# EAGLE design H2BR10 (EAGLE 9.6.2)

## Sheet 1 of 2
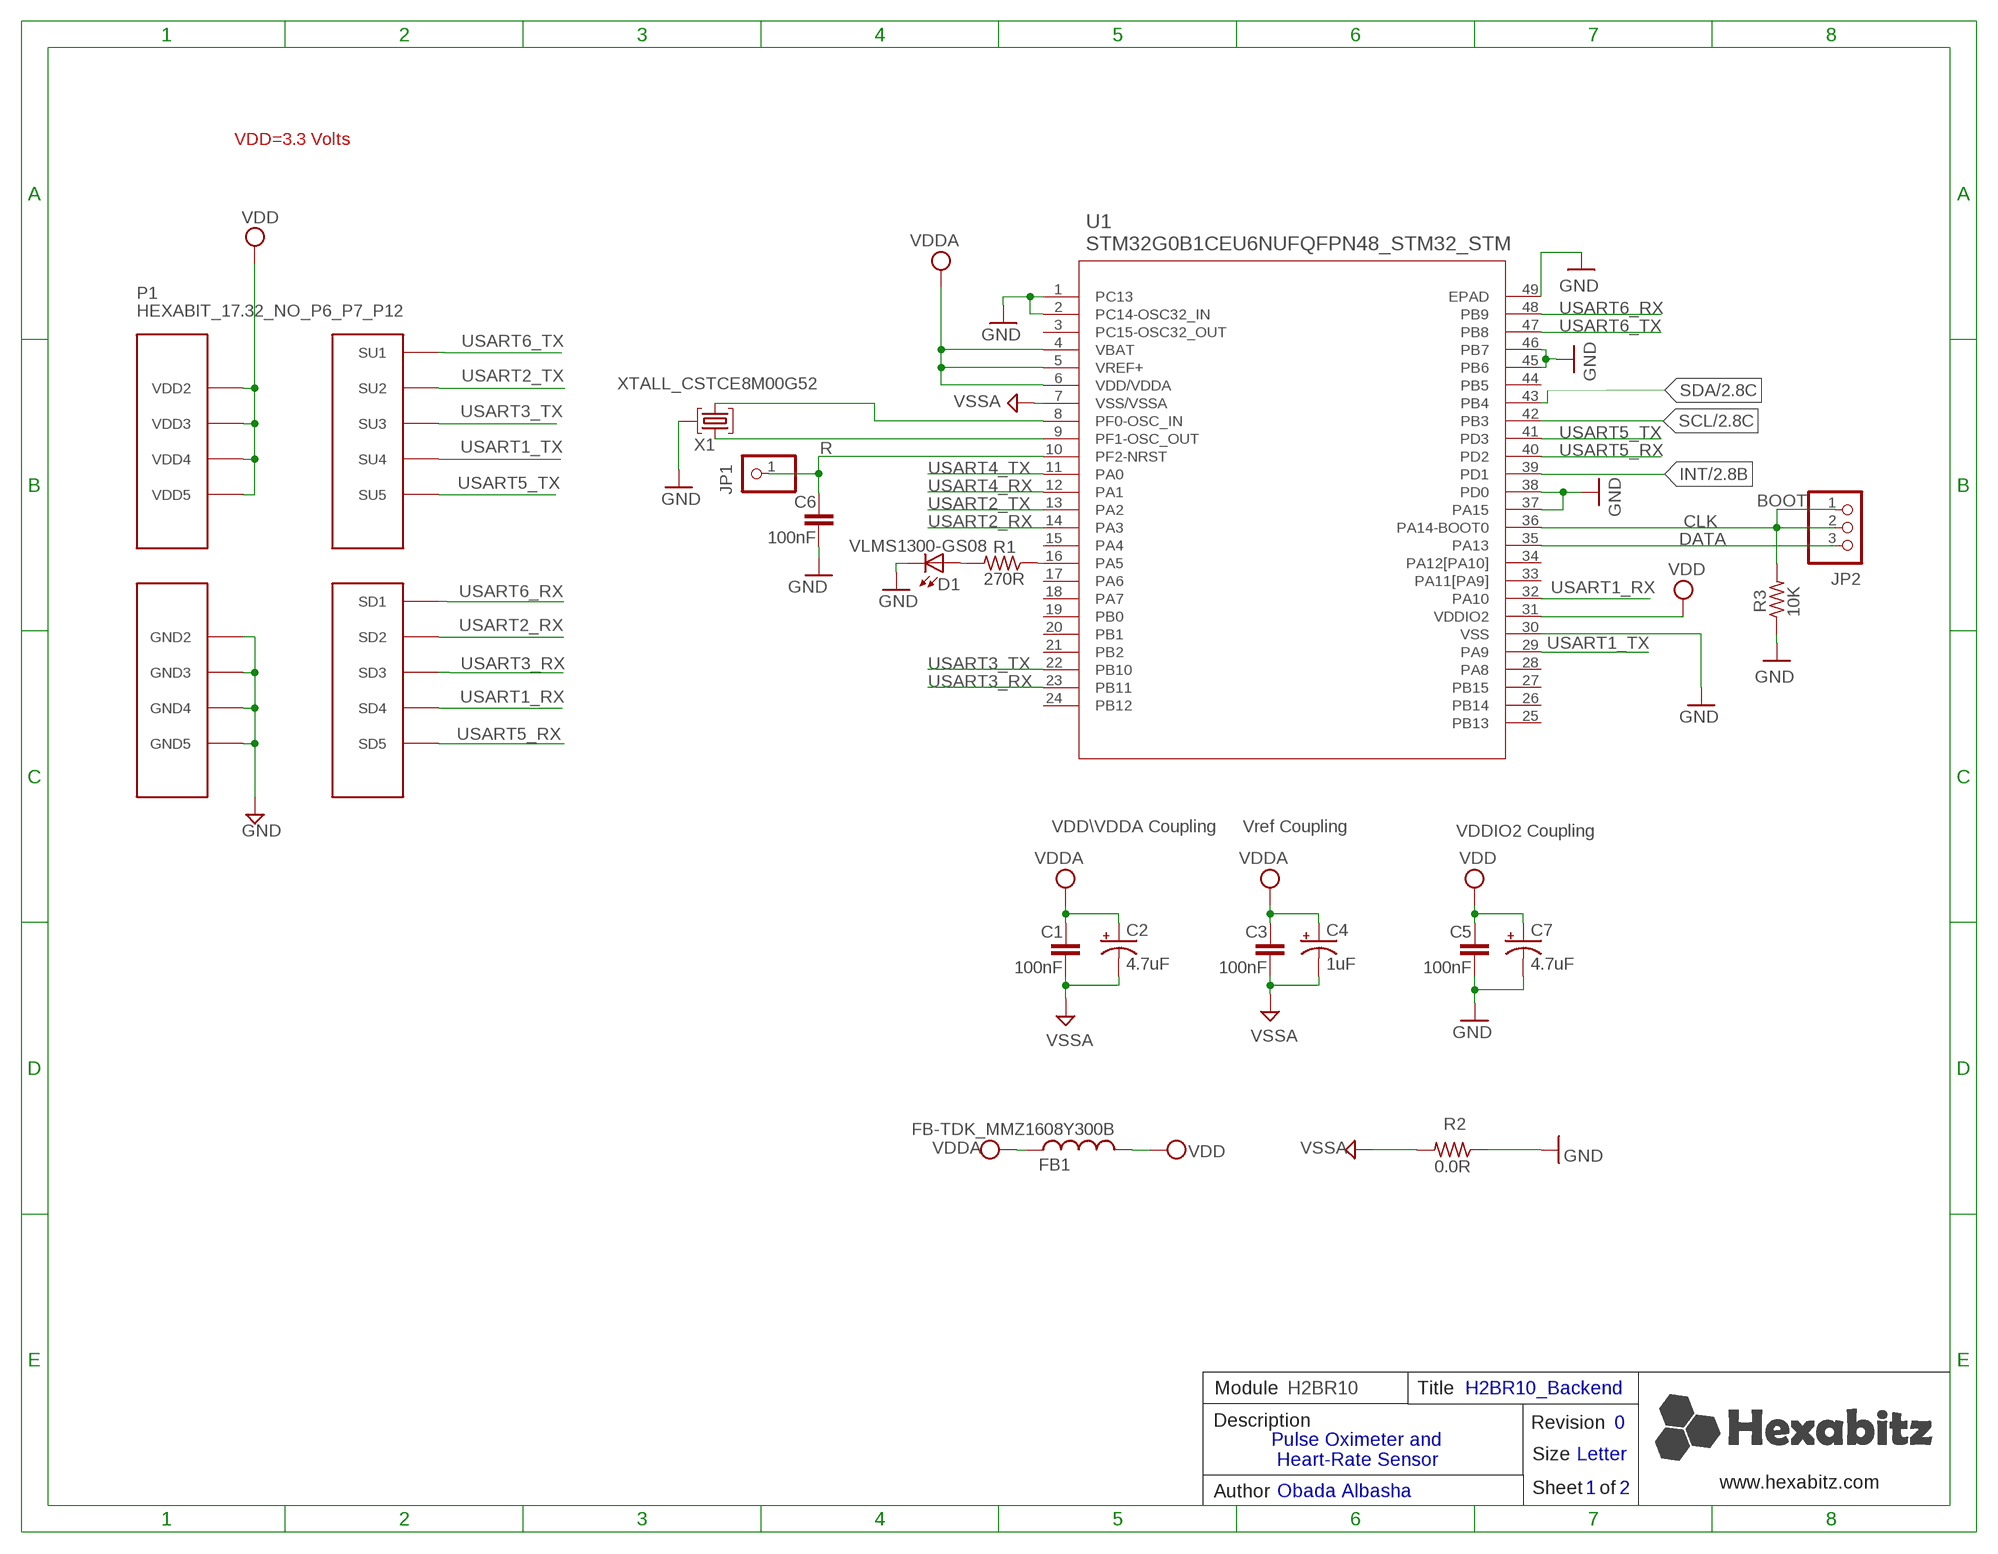
[diagram p0: schematic, sheet 1]

### Parts
C1  100nF  C-0603  [C-0603]
C2  4.7uF  C-0805-POL  [C-0805-POL]
C3  100nF  C-0603  [C-0603]
C4  1uF  C-0805-POL  [C-0805-POL]
C5  100nF  C-0603  [C-0603]
C6  100nF  C-0603  [C-0603]
C7  4.7uF  C-0805-POL  [C-0805-POL]
D1  VLMS1300-GS08  [VLMS1300-GS08]
FB1  FB-TDK_MMZ1608Y300B  [FB-TDK_MMZ1608Y300B]
JP1  R  PINHD-1X1  [1X01]
JP2  PINHD-1X3  [1X03]
P1  HEXABIT_17.32_NO_P6_P7_P12  [HEXABIT_17.32_NO_P6_P7_P12]
R1  270R  R-0603  [R-0603]
R2  0.0R  R-0603  [R-0603]
R3  10K  R-0603  [R-0603]
U1  STM32G0B1CEU6NUFQFPN48_STM32_STM  [UFQFPN48_STM32_STM]
X1  XTALL_CSTCE8M00G52  [XTALL_CSTCE8M00G52]

### Nets
CLK: JP2.1 JP2.2 R3.2 U1.36(PA14-BOOT0)
DATA: JP2.3 U1.35(PA13)
GND: C5.2 C6.2 C7.2(-) D1.C P1.PAD_PD8(GND2) P1.PAD_PD9(GND3) P1.PAD_PD10(GND4) P1.PAD_PD11(GND5) R2.1 R3.1 U1.1(PC13) U1.2(PC14-OSC32_IN) U1.30(VSS) U1.37(PA15) U1.38(PD0) U1.45(PB6) U1.46(PB7) U1.49(EPAD) X1.P$2 ; also sheet 2
INT: U1.39(PD1) ; also sheet 2
N$1: R1.1 U1.16(PA5)
N$3: D1.A R1.2
N$4: C6.1 JP1.1 U1.10(PF2-NRST)
N$5: U1.9(PF1-OSC_OUT) X1.P$1
N$6: U1.8(PF0-OSC_IN) X1.P$3
SCL: U1.42(PB3) ; also sheet 2
SDA: U1.43(PB4) ; also sheet 2
USART1_RX: P1.PAD_PD4(SD4) U1.32(PA10)
USART1_TX: P1.PAD_PU4(SU4) U1.29(PA9)
USART2_RX: P1.PAD_PD2(SD2) U1.14(PA3)
USART2_TX: P1.PAD_PU2(SU2) U1.13(PA2)
USART3_RX: P1.PAD_PD3(SD3) U1.23(PB11)
USART3_TX: P1.PAD_PU3(SU3) U1.22(PB10)
USART4_RX: U1.12(PA1)
USART4_TX: U1.11(PA0)
USART5_RX: P1.PAD_PD5(SD5) U1.40(PD2)
USART5_TX: P1.PAD_PU5(SU5) U1.41(PD3)
USART6_RX: P1.PAD_PD1(SD1) U1.48(PB9)
USART6_TX: P1.PAD_PU1(SU1) U1.47(PB8)
VDD: C5.1 C7.1(+) FB1.2 P1.PAD_PU8(VDD2) P1.PAD_PU9(VDD3) P1.PAD_PU10(VDD4) P1.PAD_PU11(VDD5) U1.31(VDDIO2) ; also sheet 2
VDDA: C1.1 C2.1(+) C3.1 C4.1(+) FB1.1 U1.4(VBAT) U1.5(VREF+) U1.6(VDD/VDDA)
VSSA: C1.2 C2.2(-) C3.2 C4.2(-) R2.2 U1.7(VSS/VSSA)
Unconnected: U1.3(PC15-OSC32_OUT) U1.15(PA4) U1.17(PA6) U1.18(PA7) U1.19(PB0) U1.20(PB1) U1.21(PB2) U1.24(PB12) U1.25(PB13) U1.26(PB14) U1.27(PB15) U1.28(PA8) U1.33(PA11[PA9]) U1.34(PA12[PA10]) U1.44(PB5)

### Notes on the sheet
- VDD=3.3 Volts
- BOOT
- VDD\VDDA Coupling | Vref Coupling | VDDIO2 Coupling
- Module | H2BR10 | Title | H2BR10_Backend
- Description | Revision | 0
- Size | Letter
- Pulse Oximeter and
   Heart-Rate Sensor
- www.hexabitz.com
- Author | Obada Albasha | Sheet   of | 1 | 2
- C:/Users/Admin/Desktop/logodraft.bmp

## Sheet 2 of 2
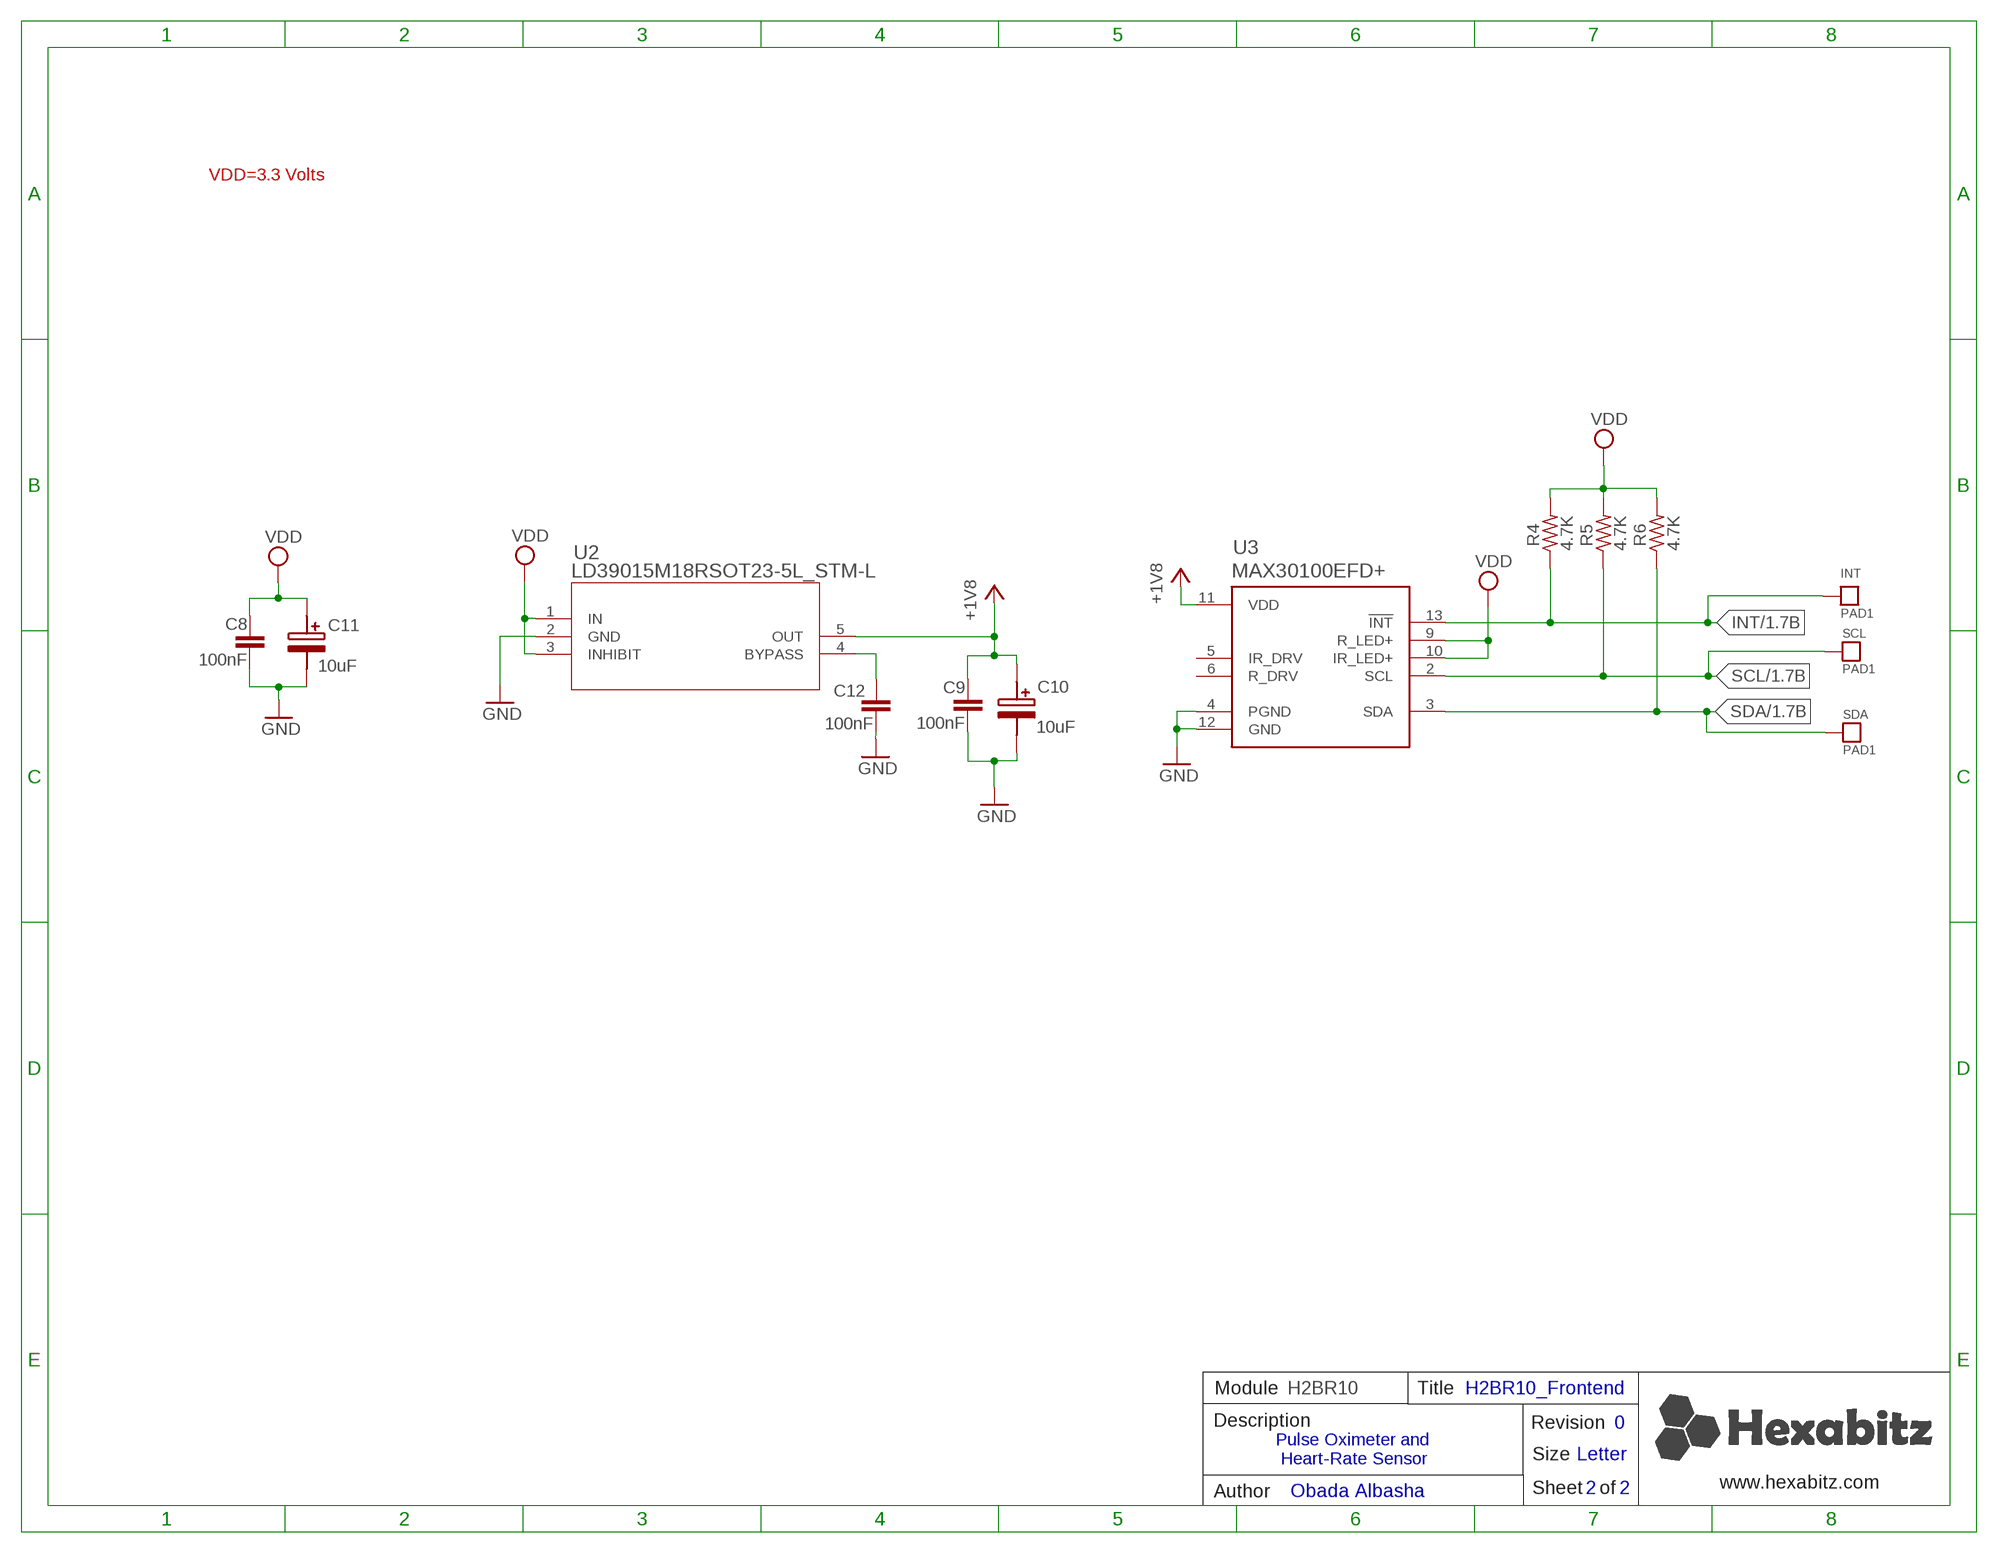
[diagram p1: schematic, sheet 2]

### Parts
C8  100nF  C-0603  [C-0603]
C9  100nF  C-0603  [C-0603]
C10  10uF  T491A106K010AT  [T491A]
C11  10uF  T491A106K010AT  [T491A]
C12  100nF  C-0603  [C-0603]
INT  PAD1  PAD4  [PAD4]
R4  4.7K  R-0603  [R-0603]
R5  4.7K  R-0603  [R-0603]
R6  4.7K  R-0603  [R-0603]
SCL  PAD1  PAD4  [PAD4]
SDA  PAD1  PAD4  [PAD4]
U2  LD39015M18RSOT23-5L_STM-L  [SOT23-5L_STM-L]
U3  MAX30100EFD+  [LGA14R80P2X7_560X280X130]

### Nets
+1V8: C9.1 C10.1(+) U2.5(OUT) U3.11(VDD)
GND: C8.2 C9.2 C10.2(-) C11.2(-) C12.2 U2.2(GND) U3.4(PGND) U3.12(GND) ; also sheet 1
INT: INT.P$1 R4.1 U3.13(!INT) ; also sheet 1
N$2: C12.1 U2.4(BYPASS)
SCL: R5.1 SCL.P$1 U3.2(SCL) ; also sheet 1
SDA: R6.1 SDA.P$1 U3.3(SDA) ; also sheet 1
VDD: C8.1 C11.1(+) R4.2 R5.2 R6.2 U2.1(IN) U2.3(INHIBIT) U3.9(R_LED+) U3.10(IR_LED+) ; also sheet 1
Unconnected: U3.5(IR_DRV) U3.6(R_DRV)

### Notes on the sheet
- VDD=3.3 Volts
- Module | H2BR10 | Title | H2BR10_Frontend
- Description | Revision | 0
- Size | Letter
- Pulse Oximeter and
   Heart-Rate Sensor
- www.hexabitz.com
- Author | Obada Albasha | Sheet   of | 2 | 2

## Library data of the parts
C1 C3 C5 C6 C8 C9 C12 = HEXABITZ_RCLS:C-0603: CAP CER 10% X7R 0603
C2 C4 C7 = HEXABITZ_RCLS:C-0805-POL: Cap Tant Solid SMD 2012
C10 C11 = HEXABITZ_RCLS:T491A106K010AT: T491, Tantalum, MnO2 Tantalum, Commercial Grade, 10 uF, 10%, 10 VDC, 125?C, -55?C, 85?C, SMD, MnO2, Molded, 6 % , 3.8 Ohms, 1000 nA, 58.6 mg, 3216, 1.6mm, Height Max = 1.8mm, 2000, 156 Weeks Source: Datasheet <https://content.kemet.com/datasheets/KEM_T2005_T491.pdf>; DESCRIPTION: T491, Tantalum, MnO2 Tantalum, Commercial Grade, 10 uF, 10%, 10 VDC, 125?C, -55?C, 85?C, SMD, MnO2, Molded, 6 % , 3.8 Ohms, 1000 nA, 58.6 mg, 3216, 1.6mm, Height Max = 1.8mm, 2000, 156 Weeks; HEIGHT: 1.8mm; MANUFACTURER_NAME: KEMET; MANUFACTURER_PART_NUMBER: T491A106K010AT; MOUSER_PART_NUMBER: 80-T491A106K010; MOUSER_PRICE-STOCK: https://www.mouser.co.uk/ProductDetail/KEMET/T491A106K010AT?qs=VCf6WUQjPgE2CESwzh%252BRVg%3D%3D
D1 = Hexabitz:VLMS1300-GS08: Red 0603 130° Clear 54 mcd 2 V Surface Mount ChipLED ; Octopart Url : http://octopart.com/vlms1300-gs08-vishay-21709201; MFN: Vishay; MPN: VLMS1300-GS08; OCTOPART_URL: https://octopart.com/vlms1300-gs08-vishay-21709201?r=sp&s=_gcP4_q8T1SC6PJQPTQ9yA
FB1 = HEXABITZ_RCLS:FB-TDK_MMZ1608Y300B: Ferrite Beads Multi-Layer 30Ohm 25% 100MHz 1.5A 50mOhm DCR 0603; MFN: TDK; MPN: MMZ1608Y300B; OCTOPART_URL: https://octopart.com/mmz1608y300b-tdk-368280?r=sp&s=cd9_2ZEqQ9q9UNBuQgHAiA
INT SCL SDA = HEXABITZ_CONNECTION_PARTS:PAD4
JP1 = HEXABITZ_USER_INTERFACE_PARTS:PINHD-1X1: PIN HEADER; MFN: TE Connectivity; MPN: 87227-1; OCTOPART_URL: https://octopart.com/87227-1-te+connectivity-39512052?r=sp
JP2 = pinhead:PINHD-1X3: PIN HEADER
P1 = hexabitz_connectors:HEXABIT_?_NO_P6_P7_P12: Hexabitz Hexagon Module Connector Hexagon side length = 17.32mm. The following ports are removed: P6 P7 P12
R1 R3-R6 = HEXABITZ_RCLS:R-0603: Thick Film Resistors - SMD 0603
R2 = HEXABITZ_RCLS:R-0603: Thick Film Resistors - SMD 0603; MFN: Yageo; MPN: RC0603JR-070RL; OCTOPART_URL: https://octopart.com/rc0603jr-070rl-yageo-1241539?r=sp&s=X2NteqRjRNWrnx42Y0aliA; RESISTANCE: 0.0 Ohm
U1 = HEXABITZ_ICs:STM32G0B1CEU6N; COPYRIGHT: Copyright (C) 2022 Ultra Librarian. All rights reserved.; MFN: STMicroelectronics; MPN: STM32G0B1CEU6N; OCTOPART_URL: https://app.ultralibrarian.com/details/c038d58b-752a-11eb-9033-0a34d6323d74/STMicroelectronics/STM32G0B1CEU6N?uid=116364672
U2 = HEXABITZ_ICs:LD39015M18R; COPYRIGHT: Copyright (C) 2022 Ultra Librarian. All rights reserved.; DIGI-KEY_PART_NUMBER_1: 497-6977-2-ND; DIGI-KEY_PART_NUMBER_2: 497-6977-1-ND; DIGI-KEY_PART_NUMBER_3: 497-6977-6-ND; MANUFACTURER_PART_NUMBER: LD39015M18R; MFR_NAME: STMicroelectronics
U3 = HEXABITZ_ICs:MAX30100EFD+: Pulse Oximeter and Heart-Rate Sensor IC 14-Pin OLGA Check availability <https://pricing.snapeda.com/parts/MAX30100EFD%2BT/Maxim%20Integrated/view-part?ref=eda>; AVAILABILITY: In Stock; DESCRIPTION: Oximeter/Heart Rate Sensor - Output; MF: Maxim Integrated; MP: MAX30100EFD+T; PACKAGE: None; PRICE: None; PURCHASE-URL: https://pricing.snapeda.com/search/part/MAX30100EFD+T/?ref=eda
X1 = Hexabitz:XTALL_CSTCE8M00G52: MURATA CSTCE8M00G52-R0 RESONATOR, SMD, 8MHZ ; Octopart Url : https://octopart.com/cstce8m00g52-r0-murata-7145559; MFN: Murata; MPN: CSTCE8M00G52Z-R0; OCTOPART_URL: https://octopart.com/cstce8m00g52z-r0-murata-17755941?r=sp&s=JDnNJnrHQhyS8Zk4ofFWXw

## Board
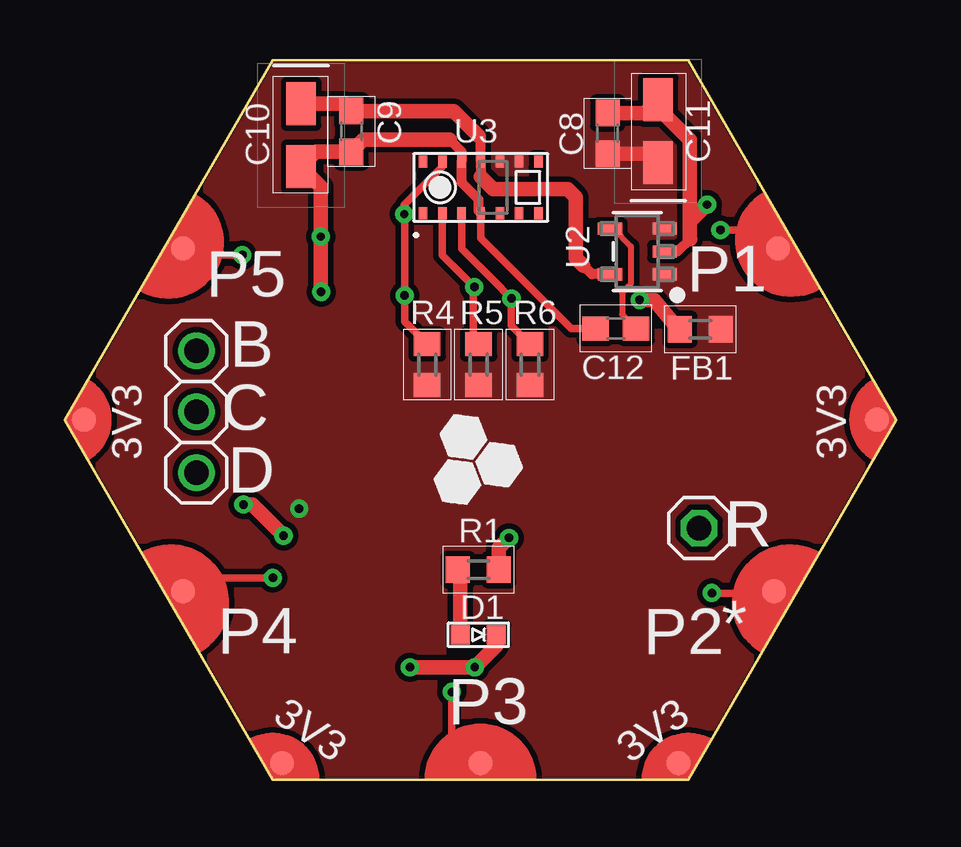
[diagram p2: board, top side]
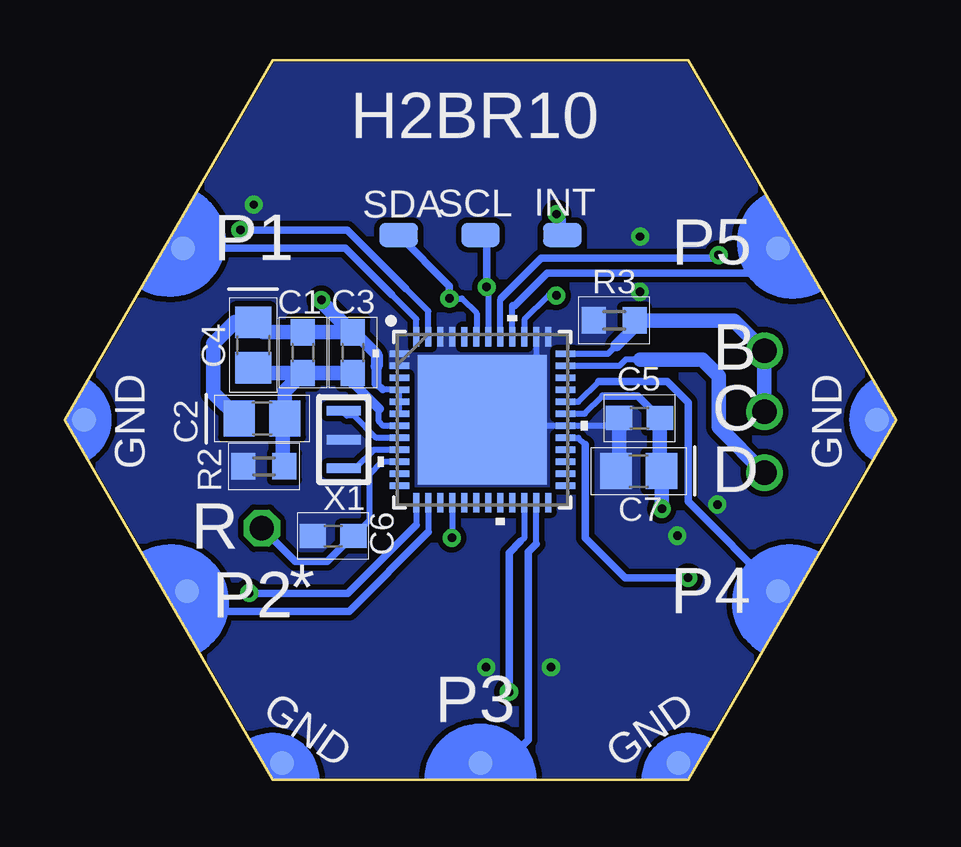
[diagram p3: board, bottom side, seen from below]

Size 34.64 x 30 mm. Coordinates in mm from the lower left corner, seen from the top.
Copper layers (1*16): Top 0.035mm / dielectric 1.5mm / Bottom 0.035mm
Design rules "Ibrahim *": minimum track width 6mil, minimum drill 0.35mm, track to track 9mil, track to pad 9mil, pad to pad 9mil, via to via 9mil, smd to smd 0mil, copper to edge 1mil, drill to drill 6mil, minimum pad ring 10mil, minimum via ring 8mil, stop-mask expansion 4mil, vias tented up to drill 24mil, thermal gap 10mil

### Footprints (pad centres in the part's own frame; a part is rotated, then mirrored left to right if it is on the bottom)
C-0603 = smd 1.1 x 1: 1 -0.85,0; 2 0.85,0
C-0805-POL = smd 1.3 x 1.5: 1 -0.95,0; 2 0.95,0
T491A = smd 1.8 x 1.23: 1 -1.31,0; 2 1.31,0
VLMS1300-GS08 = smd 0.8 x 0.8: A 0,0.75; C 0,-0.75
FB-TDK_MMZ1608Y300B = smd 1 x 1.1: 1 -0.85,0; 2 0.85,0
PAD4 = smd 1.6 x 1: P$1 0,0
1X01 = drill 1.016 octagon: 1 0,0
1X03 = drill 1.016: 1 -2.54,0; 2 0,0; 3 2.54,0
HEXABIT_17.32_NO_P6_P7_P12 = smd 1 x 1 bottom: PAD_PD1 12.39,7.15; PAD_PD2 12.231,-7.15; PAD_PD3 0,-14.31; PAD_PD4 -12.39,-7.15; PAD_PD5 -12.39,7.15; PAD_PD8 16.52,0; PAD_PD9 8.26,-14.31; PAD_PD10 -8.26,-14.31; PAD_PD11 -16.52,0 | smd 1 x 1: PAD_PU1 12.39,7.15; PAD_PU2 12.231,-7.15; PAD_PU3 0,-14.31; PAD_PU4 -12.39,-7.15; PAD_PU5 -12.39,7.15; PAD_PU8 16.52,0; PAD_PU9 8.26,-14.31; PAD_PU10 -8.26,-14.31; PAD_PU11 -16.52,0
R-0603 = smd 1 x 1.1: 1 -0.85,0; 2 0.85,0
UFQFPN48_STM32_STM = smd 0.813 x 0.254: 1 -3.454,2.751; 2 -3.454,2.251; 3 -3.454,1.75; 4 -3.454,1.25; 5 -3.454,0.75; 6 -3.454,0.25; 7 -3.454,-0.25; 8 -3.454,-0.75; 9 -3.454,-1.25; 10 -3.454,-1.75; 11 -3.454,-2.251; 12 -3.454,-2.751; 25 3.454,-2.751; 26 3.454,-2.251; 27 3.454,-1.75; 28 3.454,-1.25; 29 3.454,-0.75; 30 3.454,-0.25; 31 3.454,0.25; 32 3.454,0.75; 33 3.454,1.25; 34 3.454,1.75; 35 3.454,2.251; 36 3.454,2.751 | smd 0.254 x 0.813: 13 -2.751,-3.454; 14 -2.251,-3.454; 15 -1.75,-3.454; 16 -1.25,-3.454; 17 -0.75,-3.454; 18 -0.25,-3.454; 19 0.25,-3.454; 20 0.75,-3.454; 21 1.25,-3.454; 22 1.75,-3.454; 23 2.251,-3.454; 24 2.751,-3.454; 37 2.751,3.454; 38 2.251,3.454; 39 1.75,3.454; 40 1.25,3.454; 41 0.75,3.454; 42 0.25,3.454; 43 -0.25,3.454; 44 -0.75,3.454; 45 -1.25,3.454; 46 -1.75,3.454; 47 -2.251,3.454; 48 -2.751,3.454 | smd 5.385 x 5.385: 49 0,0
SOT23-5L_STM-L = smd 1.016 x 0.508: 1 -1.143,0.95; 2 -1.143,0; 3 -1.143,-0.95; 4 1.143,-0.95; 5 1.143,0.95
LGA14R80P2X7_560X280X130 = smd 0.5 x 0.35: 1 -1.075,2.4; 2 -1.075,1.6; 3 -1.075,0.8; 4 -1.075,0; 5 -1.075,-0.8; 6 -1.075,-1.6; 7 -1.075,-2.4; 8 1.075,-2.4; 9 1.075,-1.6; 10 1.075,-0.8; 11 1.075,0; 12 1.075,0.8; 13 1.075,1.6; 14 1.075,2.4
XTALL_CSTCE8M00G52 = smd 1.4 x 0.4: P$1 0,1.2; P$2 0,0; P$3 0,-1.2

### Placement (x,y rotation side)
C1  24.72,17.8 270 bottom
C2  26.42,15.05 0 bottom
C3  22.63,17.8 270 bottom
C4  26.79,18.12 270 bottom
C5  10.69,15.06 180 bottom
C6  23.46,10.15 180 bottom
C7  10.73,12.86 180 bottom
C8  22.62,26.94 90 top
C9  11.94,27.02 270 top
C10  9.84,26.86 270 top
C11  24.72,27.03 90 top
C12  22.96,18.81 180 top
D1  17.23,6.04 90 top
FB1  26.48,18.77 0 top
INT  13.91,22.7 0 bottom
JP1  26.43,10.48 0 top
JP2  5.49,15.33 270 top
P1  17.32,15 0 top
R1  17.23,8.75 180 top
R2  26.34,13.06 0 bottom
R3  11.75,19.14 0 bottom
R4  15.1,17.3 270 top
R5  17.24,17.3 270 top
R6  19.38,17.3 270 top
SCL  17.32,22.7 0 bottom
SDA  20.73,22.7 0 bottom
U1  17.24,15 0 bottom
U2  23.86,22.01 180 top
U3  17.33,24.69 90 top
X1  23.02,14.17 180 bottom

### Tracks (layer width: path | path; a pad name or v marks a point on that pad's centre or on a via)
+1V8
  Top 0.406: 17.24,26.83 17.33,26.74 U3.11 17.33,25.13 | U2.5 21.97,21.06 21.61,21.43
  Top 0.61: 17.24,26.83 16.2,27.87 C9.1 11.64,28.17 C10.1 | 21.61,21.43 21.29,21.75 21.29,24.29 20.96,24.61 17.85,24.61 17.33,25.13
CLK
  Bottom 0.254: U1.36 12,17.75 11.65,18.11
  Bottom 0.508: 11.65,18.11 10.9,18.85 R3.2
  Bottom 0.61: JP2.2 JP2.1 6.76,19.14 R3.2
DATA
  Bottom 0.254: U1.35 11.53,17.25 11.26,17.51 10.65,17.51
  Bottom 0.61: JP2.3 7.4,14.7 7.4,16.83 8.09,17.51 10.65,17.51
GND  (via drill 0.35)
  Top 0.305: U3.4 17.33,22.57 21.09,18.81 C12.2
  Top 0.406: 16.05,26.67 16.53,26.19 U3.12 16.53,24.89 17.24,24.18 17.24,23.71 U3.4 | 26.05,22.54 25.52,22.01 U2.2
  Top 0.61: v10.68,20.33 10.67,20.35 v10.67,22.63 10.67,24.73 C10.2 10.46,26.17 C9.2 12.44,26.67 16.05,26.67 | v9.12,10.16 7.82,11.46 v7.45,11.46 | v14.38,4.68 v17.08,4.68 17.98,5.58 D1.C | C8.2 24.17,27.79 C11.2 24.72,27.99 26.04,26.67 26.04,23.26 | 26.05,22.54 26.04,22.55 26.04,23.26 | 26.04,23.26 v26.76,23.97 v26.77,23.97
  Bottom 0.254: 11.54,12.99 11.64,12.9 C7.2 | C5.2 11.94,14.75 U1.30 14.64,14.75 14.68,14.71 | U1.38 14.99,17.52
  Bottom 0.305: 17.41,17.17 17.41,17.18 | 27.19,13.09 R2.1
  Bottom 0.406: 11.64,13.13 11.64,12.9 | 14.99,17.52 15.02,17.49
  Bottom 0.61: C5.2 11.54,12.99
  pour Bottom (no thermals): 8.6,-0.07 25.96,-0.07 34.6,14.91 25.94,29.92 8.55,29.92 -0.08,14.97
INT  (via drill 0.35)
  Top 0.305: U3.13 15.73,25.56 14.14,23.97 v14.14,23.57 14.16,23.56 v14.16,20.18 14.16,19.09 R4.1
  Bottom 0.254: v14.16,20.18 14.48,20.18 15.49,19.17 U1.39
  Bottom 0.305: INT.P$1 13.91,23.33 v14.14,23.57
N$1  (via drill 0.35)
  Top 0.61: R1.1 18.08,9.65 v18.51,10.08
  Bottom 0.254: U1.16 18.49,10.1 v18.51,10.08
N$2
  Top 0.254: U2.4 22.85,22.96 23.59,22.22 23.58,22.21 23.58,20.66 23.22,20.3 23.22,19.4 C12.1
N$3
  Top 0.61: R1.2 16.48,8.65 D1.A
N$4
  Bottom 0.254: U1.10 20.71,13.23 21.43,13.23 21.96,12.7 21.96,10.81 C6.1
  Bottom 0.305: C6.1 22.64,10.15 23.71,9.09 25.04,9.09 JP1.1
N$5
  Bottom 0.254: U1.9 21.78,13.75 22.55,12.97 X1.P$1
N$6
  Bottom 0.254: X1.P$3 23.02,15.3 22.89,15.17 22.58,15.17 21.66,14.25 U1.8
SCL  (via drill 0.35)
  Top 0.305: U3.2 15.73,21.87 17.02,20.58 | 17.02,20.58 v17.06,20.54 | R5.1 17.02,18.37 17.02,20.58
  Bottom 0.254: v17.06,20.54 16.99,20.47 U1.42
  Bottom 0.305: v17.06,20.54 17.06,22.44 SCL.P$1
SDA  (via drill 0.35)
  Top 0.305: U3.3 16.53,22.14 17.82,20.85 v18.61,20.06 18.61,18.92 R6.1
  Bottom 0.254: v18.61,20.06 18.09,20.06 17.48,19.45 17.48,18.47 U1.43
  Bottom 0.305: v18.61,20.06 18.61,20.58 SDA.P$1
USART1_RX
  Bottom 0.254: U1.32 13.24,15.75 12.4,16.59
  Bottom 0.305: P1.PAD_PD4 8.67,11.59 8.67,15.71 9.54,16.59 12.4,16.59
USART1_TX  (via drill 0.35)
  Top 0.305: P1.PAD_PU4 5.49,8.41 v8.67,8.41
  Bottom 0.254: U1.29 13.24,14.25 12.95,13.97
  Bottom 0.305: v8.67,8.41 11.29,8.41 12.95,10.08 12.95,13.97
USART2_RX
  Bottom 0.254: U1.14 19.49,10.32
  Bottom 0.305: P1.PAD_PD2 28.72,7.02 22.8,7.02 19.49,10.32
USART2_TX  (via drill 0.35)
  Top 0.305: v26.96,7.78 26.97,7.77 29.47,7.77 P1.PAD_PU2
  Bottom 0.254: U1.13 20,10.62
  Bottom 0.305: v26.96,7.78 26.95,7.77 22.85,7.77 20,10.62
USART3_RX
  Bottom 0.254: 14.99,9.83 U1.23
  Bottom 0.305: P1.PAD_PD3 16.98,1.03 15.97,1.03 15.34,1.67 15.34,9.48 14.99,9.83 | 14.99,9.83
USART3_TX  (via drill 0.35)
  Top 0.305: v16.13,3.65 16.13,1.88 P1.PAD_PU3
  Bottom 0.254: U1.22 15.49,10.08 15.65,9.92
  Bottom 0.305: 15.65,9.92 16.13,9.44 v16.13,3.65
USART5_RX
  Bottom 0.254: U1.40 15.99,19.74 15.97,19.76
  Bottom 0.305: 15.97,19.76 15.89,19.76 14.54,21.11 5.97,21.11 P1.PAD_PD5
USART5_TX  (via drill 0.35)
  Top 0.305: v7.4,21.87 5.21,21.87 P1.PAD_PU5
  Bottom 0.254: U1.41 16.49,20.04 16.45,20.08
  Bottom 0.305: 16.45,20.08 14.78,21.75 7.4,21.75 v7.4,21.87
USART6_RX
  Bottom 0.254: U1.48 19.99,19.19 21.02,20.22
  Bottom 0.305: 21.02,20.22 22.95,22.15 P1.PAD_PD1
USART6_TX  (via drill 0.35)
  Top 0.305: v27.32,22.91 28.95,22.91 P1.PAD_PU1
  Bottom 0.254: U1.47 19.49,19.53 20.43,20.47
  Bottom 0.305: 20.43,20.47 22.87,22.91 v27.32,22.91
VDD  (via drill 0.35)
  Top 0.61: C8.1 24.35,26.09 C11.1
  Bottom 0.254: C5.1 | 9.84,12.92 C7.1 | U1.31 12.97,15.25 12.23,16
  Bottom 0.305: 12.23,16 10.78,16 C5.1
  Bottom 0.61: C5.1 9.84,12.92 | C7.1 v9.76,11.29
  pour Top (no thermals): 8.55,-0.07 25.98,-0.07 34.57,14.9 25.93,29.94 8.61,29.91 -0.07,14.87
VDDA  (via drill 0.35)
  Top 0.61: FB1.1 25.56,18.77 24.55,19.99 v23.95,19.99
  Bottom 0.254: U1.6 U1.5 U1.4 21.4,16.25
  Bottom 0.305: 21.4,16.25 21.65,16.5
  Bottom 0.406: 21.65,16.5 21.65,17.23
  Bottom 0.508: 22.61,18.67 21.65,17.72 21.65,17.23
  Bottom 0.61: C3.1 C1.1 26.37,18.65 C4.1 27.55,19.07 28.45,18.18 28.45,16.12 C2.1 | C3.1 22.61,18.67 | v23.95,19.99 23.95,19.92 22.68,18.65 C3.1
VSSA
  Bottom 0.254: U1.7 21.39,14.75 21.55,14.92 21.55,15.47
  Bottom 0.406: 21.55,15.47 22.63,16.54
  Bottom 0.508: 22.63,16.54 C3.2
  Bottom 0.61: R2.2 25.55,13.12 25.55,14.97 C2.2 25.47,16.2 C1.2 | C1.2 C3.2 | C4.2 26.57,16.95 C1.2

### Text on the board
tPlace: P5 | P1 | 3V3 | 3V3 | P4 | P2 | * | P3 | 3V3 | 3V3
bPlace: H2BR10 | P5 | P1 | GND | GND | P4 | * | P2 | P3 | GND | GND
tNames: B | C | D | R
bNames: . | B | C | D | R